# EAGLE design FeatherBME280 (EAGLE 9.2.2)
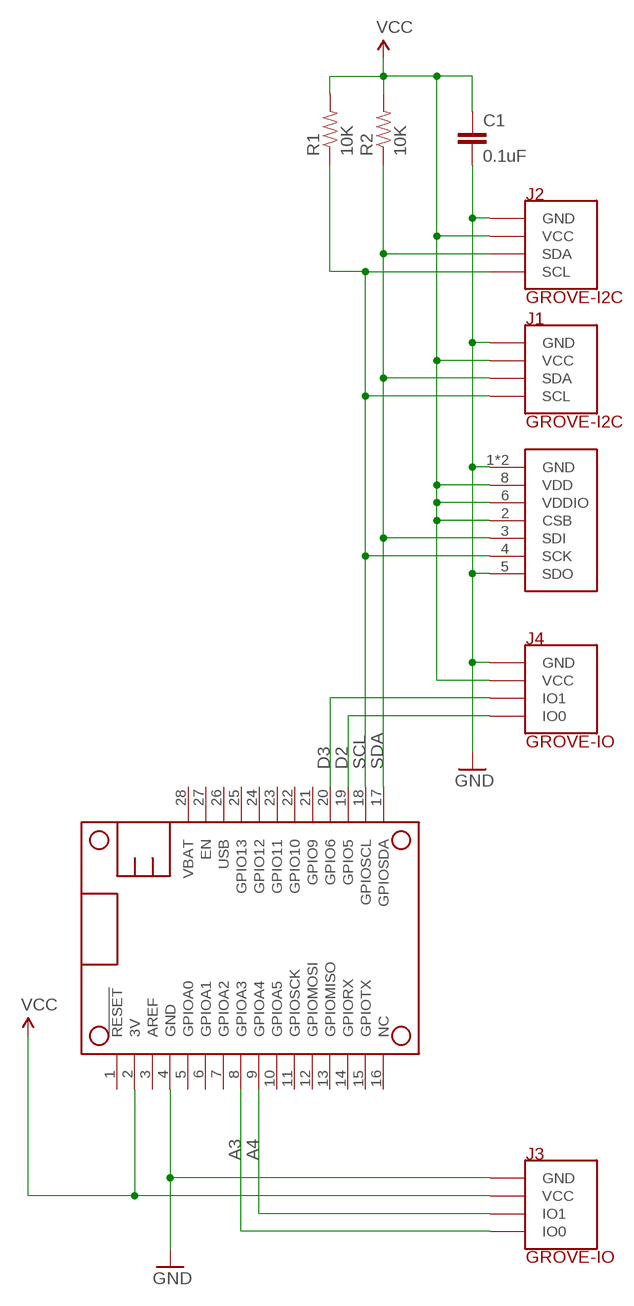
[diagram p0: schematic, sheet 1]

## Parts
C1  0.1uF  CAP-0.1UF-0603  [0603-CAP]
J1  GROVE-I2C  [GROVE-VERT-PTH]
J2  GROVE-I2C  [GROVE-VERT-PTH]
J3  GROVE-IO  [GROVE-VERT-PTH]
J4  GROVE-IO  [GROVE-VERT-PTH]
MS1  FEATHERWING  [FEATHERWING]
R1  10K  RES-10K-06030603  [0603-RES]
R2  10K  RES-10K-06030603  [0603-RES]
U$1  BME280  [BME280]

## Nets
A3: J3.1(IO0) MS1.8(GPIOA3)
A4: J3.2(IO1) MS1.9(GPIOA4)
D2: J4.1(IO0) MS1.19(GPIO5)
D3: J4.2(IO1) MS1.20(GPIO6)
GND: C1.2 J1.4(GND) J2.4(GND) J3.4(GND) J4.4(GND) MS1.4(GND) U$1.1(GND) U$1.5(SDO) U$1.7(GND)
SCL: J1.1(SCL) J2.1(SCL) MS1.18(GPIOSCL) R1.1 U$1.4(SCK)
SDA: J1.2(SDA) J2.2(SDA) MS1.17(GPIOSDA) R2.1 U$1.3(SDI)
VCC: C1.1 J1.3(VCC) J2.3(VCC) J3.3(VCC) J4.3(VCC) MS1.2(3V) R1.2 R2.2 U$1.2(CSB) U$1.6(VDDIO) U$1.8(VDD)
Unconnected: MS1.1(!RESET) MS1.3(AREF) MS1.5(GPIOA0) MS1.6(GPIOA1) MS1.7(GPIOA2) MS1.10(GPIOA5) MS1.11(GPIOSCK) MS1.12(GPIOMOSI) MS1.13(GPIOMISO) MS1.14(GPIORX) MS1.15(GPIOTX) MS1.16(NC) MS1.21(GPIO9) MS1.22(GPIO10) MS1.23(GPIO11) MS1.24(GPIO12) MS1.25(GPIO13) MS1.26(USB) MS1.27(EN) MS1.28(VBAT)

## Library data of the parts
C1 = rickk2:CAP-0.1UF-0603: CAP CER 0.1UF 16V X7R 0603 https://www.digikey.com/product-detail/en/murata-electronics-north-america/GRM188R71C104KA01D/490-1532-1-ND/587771
J1 J2 = rickk2:GROVE-I2C: GROVE 2MM 4PIN CONN 10PACK $1.68 https://www.digikey.com/product-detail/en/seeed-technology-co-ltd/110990030/1597-1082-ND/5482560 GROVE 2MM 4PIN R/A CONN 10PACK $1.53 https://www.digikey.com/product-detail/en/seeed-technology-co-ltd/110990037/1597-1083-ND/5482561 Key on right Top 4 Black - GND 3 Red - VCC 2 White - SDA / TX / Secondary digital or analog 1 Yellow - SCL / RX / Primary digital or analog Bottom
J3 J4 = rickk2:GROVE-IO: GROVE 2MM 4PIN CONN 10PACK $1.68 https://www.digikey.com/product-detail/en/seeed-technology-co-ltd/110990030/1597-1082-ND/5482560 GROVE 2MM 4PIN R/A CONN 10PACK $1.53 https://www.digikey.com/product-detail/en/seeed-technology-co-ltd/110990037/1597-1083-ND/5482561 Key on right Top 4 Black - GND 3 Red - VCC 2 White - SDA / TX / Secondary digital or analog 1 Yellow - SCL / RX / Primary digital or analog Bottom
MS1 = microbuilder:FEATHERWING
R1 R2 = rickk2:RES-10K-0603: RES SMD 10K OHM 5% 1/4W 0603 $ 0.10 https://www.digikey.com/product-detail/en/panasonic-electronic-components/ERJ-PA3J103V/P10KBZCT-ND/5036237
U$1 = rickk2:BME280: https://www.digikey.com/product-detail/en/bosch-sensortec/BME280/828-1063-1-ND/6136314

## Board
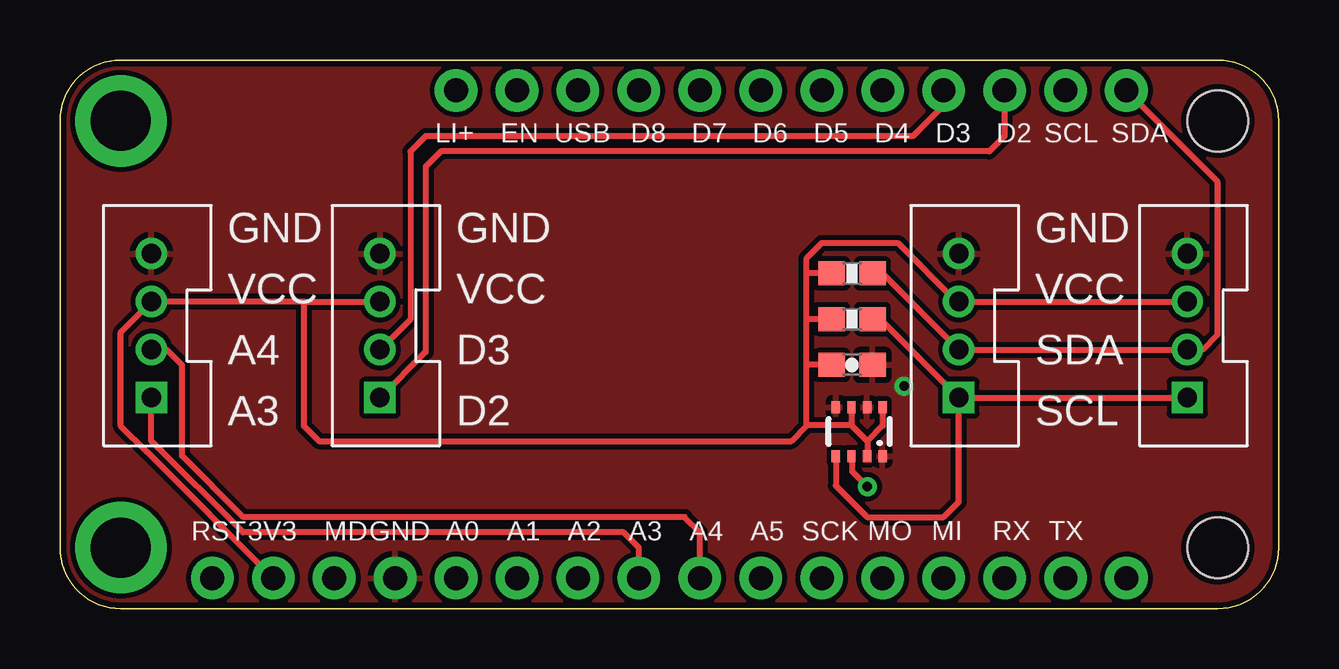
[diagram p1: board, top side]
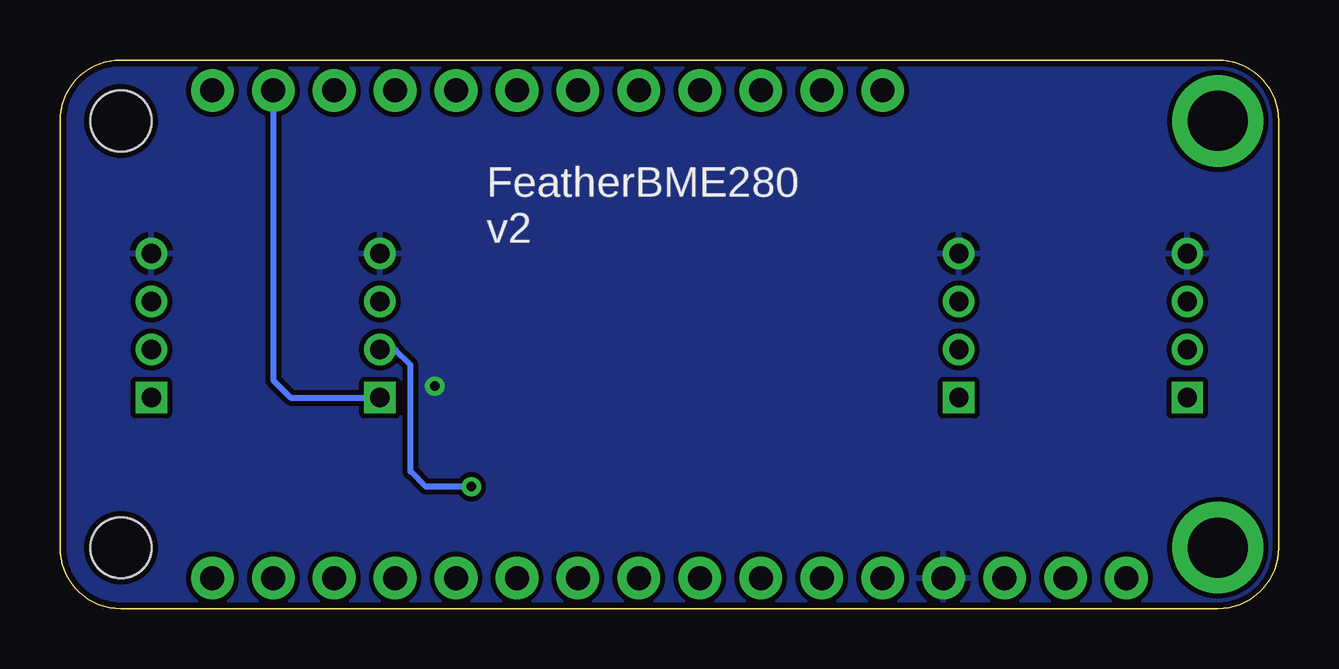
[diagram p2: board, bottom side, seen from below]

Size 50.8 x 22.86 mm. Coordinates in mm from the lower left corner, seen from the top.
Outline: 2.54,22.86 48.26,22.86 arc-90 50.8,20.32 50.8,2.54 arc-90 48.26,0 2.54,0 arc-90 0,2.54 0,20.32 arc-90 2.54,22.86
Copper layers (1*16): Top 0.035mm / dielectric 1.5mm / Bottom 0.035mm
Design rules "adafruit": minimum track width 8mil, minimum drill 15.5mil, track to track 8mil, track to pad 8mil, pad to pad 8mil, via to via 8mil, smd to smd 8mil, copper to edge 10mil, drill to drill 8mil, minimum pad ring 10mil, minimum via ring 8mil, stop-mask expansion 2mil, vias tented up to drill 20mil, thermal gap 10mil

### Footprints (pad centres in the part's own frame; a part is rotated, then mirrored left to right if it is on the bottom)
0603-CAP = smd 1.1 x 1: 1 -0.85,0; 2 0.85,0
GROVE-VERT-PTH = drill 0.8 square: 1 -2,0 | drill 0.8: 2 0,0; 3 2,0; 4 4,0
FEATHERWING = drill 1 pad 1.778: 1 6.35,1.27; 2 8.89,1.27; 3 11.43,1.27; 4 13.97,1.27; 5 16.51,1.27; 6 19.05,1.27; 7 21.59,1.27; 8 24.13,1.27; 9 26.67,1.27; 10 29.21,1.27; 11 31.75,1.27; 12 34.29,1.27; 13 36.83,1.27; 14 39.37,1.27; 15 41.91,1.27; 16 44.45,1.27; 17 44.45,21.59; 18 41.91,21.59; 19 39.37,21.59; 20 36.83,21.59; 21 34.29,21.59; 22 31.75,21.59; 23 29.21,21.59; 24 26.67,21.59; 25 24.13,21.59; 26 21.59,21.59; 27 19.05,21.59; 28 16.51,21.59 | drill 2.5 pad 3.81: P$1 2.54,20.32; P$2 2.54,2.54 | hole 2.54: 48.26,20.32; 48.26,2.54
0603-RES = smd 1.1 x 1: 1 -0.85,0; 2 0.85,0
BME280 = smd 0.35 x 0.5: 1 0,0; 2 0.65,0; 3 1.3,0; 4 1.95,0; 5 1.95,-2.05; 6 1.3,-2.05; 7 0.65,-2.05; 8 0,-2.05

### Placement (x,y rotation side)
C1  33.02,10.16 0 top
J1  46.99,10.79 90 top
J2  37.47,10.79 90 top
J3  3.81,10.79 90 top
J4  13.34,10.79 90 top
MS1  0,0 0 top
R1  33.02,12.06 180 top
R2  33.02,13.97 180 top
U$1  34.29,6.35 180 top

### Tracks (layer width: path | path; a pad name or v marks a point on that pad's centre or on a via)
A3
  Top 0.254: MS1.8 24.13,2.54 23.5,3.17 7.63,3.17 3.82,6.99 3.81,6.99 J3.1
A4
  Top 0.254: MS1.9 26.67,3.17 26.04,3.81 7.64,3.81 5.09,6.36 5.09,10.15 4.45,10.79 J3.2
D2
  Top 0.254: MS1.19 39.37,19.68 38.73,19.05 15.88,19.05 15.24,18.41 15.24,10.7 J4.1
D3
  Top 0.254: MS1.20 36.83,20.95 35.56,19.68 15.24,19.68 14.61,19.05 14.61,12.06 J4.2
GND  (via drill 0.39)
  other vias: 35.18,9.27
  pour Top: 0,0 0,25.4 53.34,25.4 53.34,0
  pour Bottom: 0,0 0,27.94 55.88,27.94 55.88,0
SCL
  Top 0.254: J2.1 J1.1 | J2.1 34.2,12.06 R1.1 | U$1.4 32.34,5.12 33.66,3.81 36.83,3.81 37.47,4.45 J2.1
  Bottom 0.254: MS1.18 41.91,9.53 41.18,8.79 J2.1
SDA  (via drill 0.39)
  Top 0.254: MS1.17 48.26,17.78 48.26,11.43 47.62,10.79 J1.2 J2.2 34.29,13.97 R2.1 | U$1.3 33.02,6.32 33.02,5.71 v33.66,5.08
  Bottom 0.254: J2.2 36.83,10.79 36.2,10.16 36.2,5.71 35.56,5.08 v33.66,5.08
VCC
  Top 0.254: 10.16,12.79 J4.3 | 10.16,12.79 10.16,7.62 10.79,6.99 30.48,6.99 31.11,7.62 | J1.3 J2.3 37.37,12.79 34.92,15.24 31.75,15.24 31.11,14.61 31.11,13.97 | MS1.2 3.63,6.53 3.62,6.53 2.54,7.61 2.54,11.53 J3.3 10.16,12.79 | U$1.2 33.66,6.37 33.66,6.99 | 31.11,7.62 31.11,10.16 | 31.11,10.16 31.11,12.06 | 31.11,12.06 31.11,13.97 | R2.2 31.11,13.97 | R1.2 31.11,12.06 | C1.1 31.11,10.16 | U$1.8 34.29,7.62 33.66,6.99 | 32.99,7.65 33.66,6.99 | 32.99,7.65 31.14,7.65 31.11,7.62 | U$1.6 32.99,7.65

### Text on the board
tPlace: LI+ | EN | USB | D8 | D7 | D6 | D5 | D4 | D3 | D2 | SCL | SDA | GND | GND | GND | VCC | VCC | VCC | A4 | D3 | SDA | A3 | D2 | SCL | RST | 3V3 | MD | GND | A0 | A1 | A2 | A3 | A4 | A5 | SCK | MO | MI | RX | TX
bPlace: FeatherBME280 / v2